# Altium schematic sheet 09_Memory.SchDoc: Memory
size A4; SheetNumber: 10; SheetTotal: 10
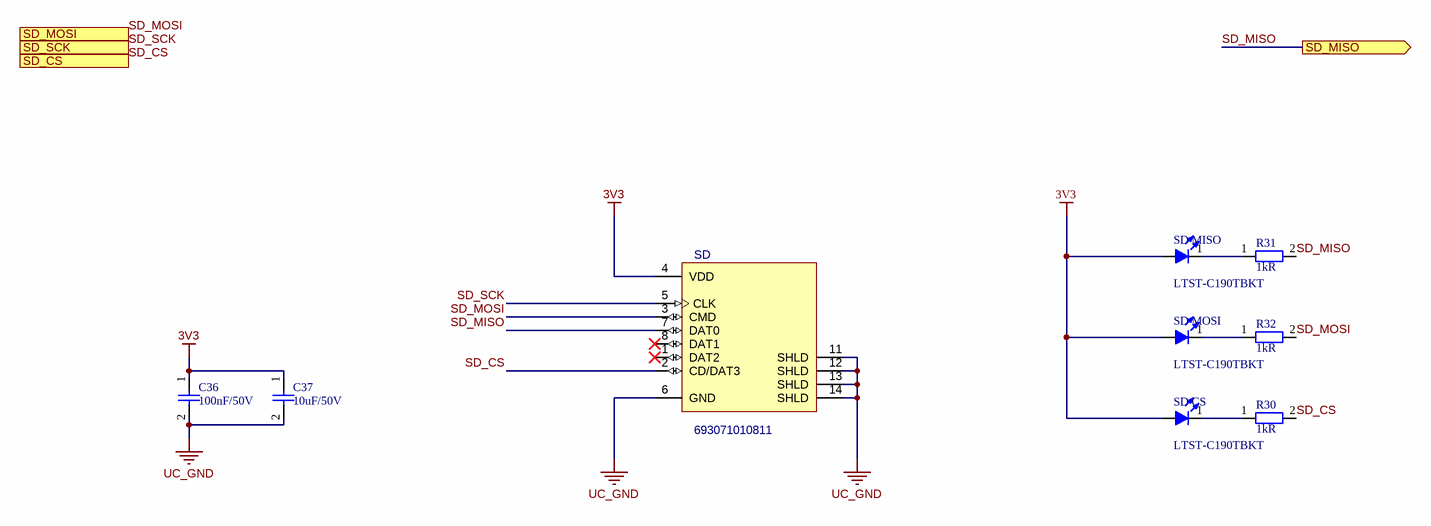
[diagram p0: 09_Memory.SchDoc]

## Parts
C36  100nF/50V  [CAPC1005X05L]
C37  10uF/50V  [CAPC3216X12L]
R30  1kR  [RESC1005X04L]
R31  1kR  [RESC1005X04L]
R32  1kR  [RESC1005X04L]
SD  693071010811  [WUERTH_693071010811]
SD_CS  LTST-C190TBKT  [LEDSC160X80X80-2Lbl]
SD_MISO  LTST-C190TBKT  [LEDSC160X80X80-2Lbl]
SD_MOSI  LTST-C190TBKT  [LEDSC160X80X80-2Lbl]

## Ports
SD_CS, SD_MISO (out), SD_MOSI (in), SD_SCK

## Nets
3V3: C36.1 C37.1 SD.4(VDD) SD_CS.2(A) SD_MISO.2(A) SD_MOSI.2(A)
UC_GND: C36.2 C37.2 SD.6(GND) SD.11(SHLD) SD.12(SHLD) SD.13(SHLD) SD.14(SHLD)
SD_CS: R30.2 SD.2(CD/DAT3) ; port SD_CS
SD_MISO: R31.2 SD.7(DAT0) ; port SD_MISO
SD_MOSI: R32.2 SD.3(CMD) ; port SD_MOSI
SD_SCK: SD.5(CLK) ; port SD_SCK
NetR30_1: R30.1 SD_CS.1(K)
NetR31_1: R31.1 SD_MISO.1(K)
NetR32_1: R32.1 SD_MOSI.1(K)

Not connected (* = marked no-connect by the designer): SD 1(DAT2)* 8(DAT1)*

## Notes on the sheet
- Schematic Name
- Document Number
- File:
- Sheet
- Size
- A4
- Project Name
- of
- Print date:
- Drawn by:
- Revision
- Repo:
- Variant:

## Library data of the parts
C36 = CMP-001-00067-18: Cap MLCC, 100nF, 50V, X7R, 10%, 0402; Designator: C; Value: 100nF; Case/Package: 0402; Case Code (Metric): 1005; Dielectricum: X7R; Mounting Technology: SMD; Tolerance: 10%; Type: MLCC; Voltage Rating: 50V
C37 = CMP-001-00092-17: Cap MLCC, 10uF, 50V, X5R, 10%, 1206; Designator: C; Value: 10µF; Case/Package: 1206; Case Code (Metric): 3216; Dielectricum: X5R; Mounting Technology: SMD; Tolerance: 10%; Type: MLCC; Voltage Rating: 50V
R30-R32 = CMP-009-00009-32: Res, 1kR, 1%, 0.1W, 0402; Value: 1k; Power: 100mW; Voltage Rating: 50V; Case/Package: 0402; Case Code (Metric): 1005; Mounting Technology: SMD; Tolerance: 1%; Type: Fixed
SD = CMP-002-00218-6: SD-Card Micro Connector, 8 Position, Push In, Push Out, SMD; Manufacturer: Würth; Designator: CON; Angle: Horizontal; Connection: Pluggable; Family Name: WR-CRD; Max Voltage: 100V; Type: SD-Card; Mounting Technology: SMD; Pins: 8; Size: L15.2B14H2.1
SD_CS SD_MISO SD_MOSI = CMP-007-00026-12: LED, Blue, 20mA, 2.8V, 0603; Case/Package: 0603; Color: Blue; Forward Voltage: 2.8V; Mounting Technology: SMD; Rated Current: 20mA; Size: L1.6B0.8H0.8